# EAGLE design hbridge_v3 (EAGLE 6.4)
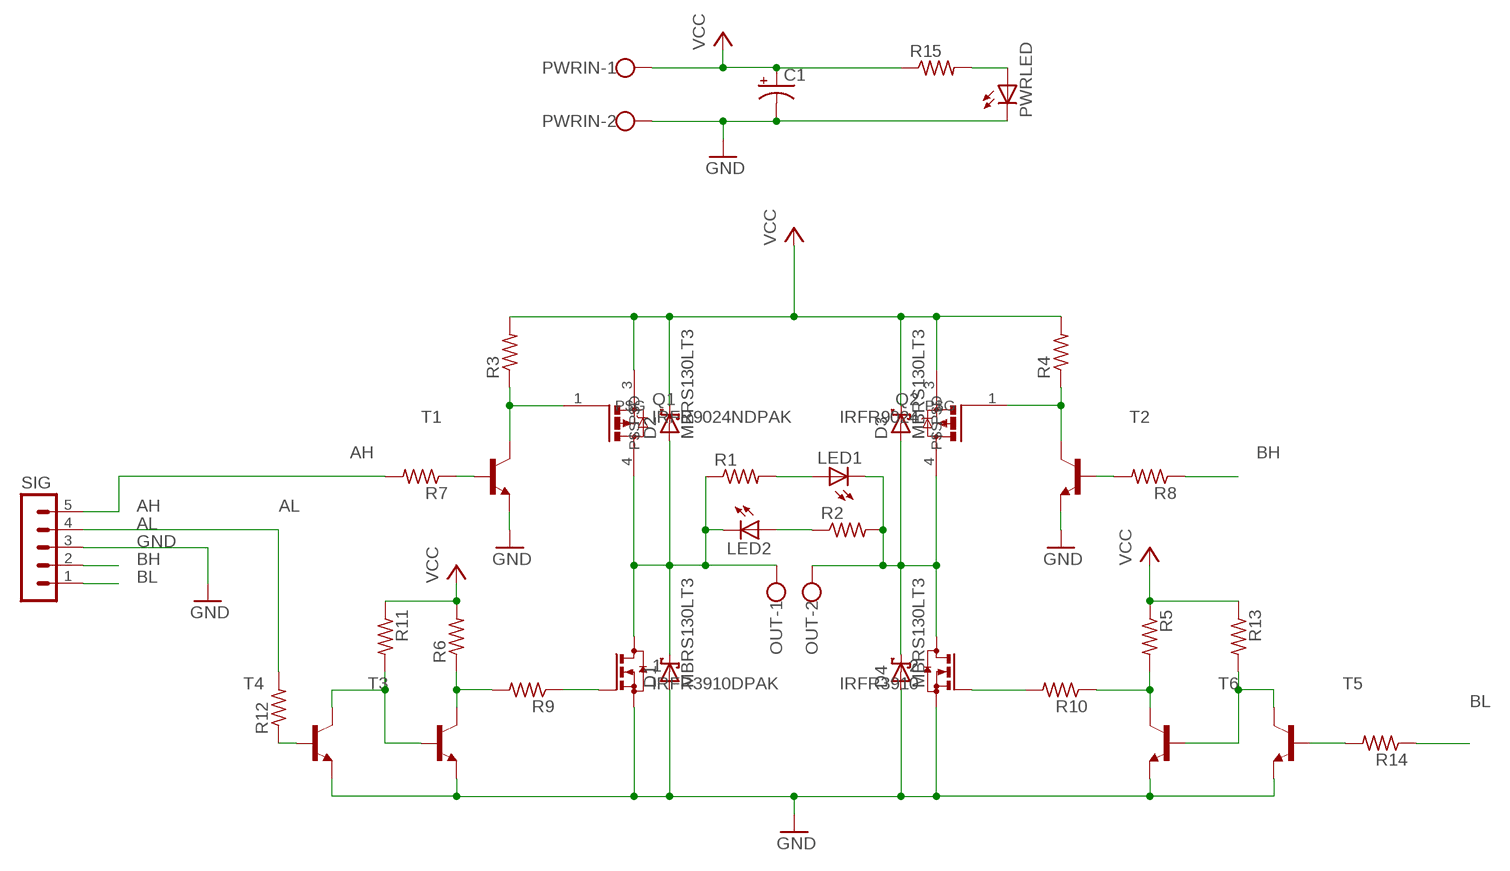
[diagram p0: schematic, sheet 1]

## Parts
1  IRFR3910DPAK  [D-PAK_TO252AA]
2  IRFR3910  IRFR3910DPAK  [D-PAK_TO252AA]
C1  CPOL-USE5-10.5  [E5-10,5]
D1  MBRS130LT3  [SMB]
D2  MBRS130LT3  [SMB]
D3  MBRS130LT3  [SMB]
D4  MBRS130LT3  [SMB]
LED1  LEDCHIP-LED0805  [CHIP-LED0805]
LED2  LEDCHIP-LED0805  [CHIP-LED0805]
OUT  W237-102  [W237-102]
PWRIN  W237-102  [W237-102]
PWRLED  LEDCHIP-LED0805  [CHIP-LED0805]
Q1  IRFR9024NDPAK  [D-PAK_TO252AA]
Q2  IRFR9024  IRFR9024NDPAK  [D-PAK_TO252AA]
R1  R-US_R0805  [R0805]
R2  R-US_R0805  [R0805]
R3  R-US_R0805  [R0805]
R4  R-US_R0805  [R0805]
R5  R-US_R0805  [R0805]
R6  R-US_R0805  [R0805]
R7  R-US_R0805  [R0805]
R8  R-US_R0805  [R0805]
R9  R-US_R0805  [R0805]
R10  R-US_R0805  [R0805]
R11  R-US_R0805  [R0805]
R12  R-US_R0805  [R0805]
R13  R-US_R0805  [R0805]
R14  R-US_R0805  [R0805]
R15  R-US_R0805  [R0805]
SIG  MA05-1  [MA05-1]
T1  MMBT2222ALT1-NPN-SOT23-BEC  [SOT23-BEC]
T2  MMBT2222ALT1-NPN-SOT23-BEC  [SOT23-BEC]
T3  MMBT2222ALT1-NPN-SOT23-BEC  [SOT23-BEC]
T4  MMBT2222ALT1-NPN-SOT23-BEC  [SOT23-BEC]
T5  MMBT2222ALT1-NPN-SOT23-BEC  [SOT23-BEC]
T6  MMBT2222ALT1-NPN-SOT23-BEC  [SOT23-BEC]

## Nets
AH: R7.2 SIG.5
AL: R12.2 SIG.4
BH: R8.1 SIG.2
BL: R14.1 SIG.1
GND: 1.3(S) 2.3(S) C1.- D1.A D4.A PWRIN.2 PWRLED.C SIG.3 T1.E T2.E T3.E T4.E T5.E T6.E
M1: 1.4(D) D1.C D2.A LED2.C OUT.1 Q1.4(P$D) R1.1
M2: 2.4(D) D3.A D4.C LED1.C OUT.2 Q2.4(P$D) R2.2
N$1: LED2.A R2.1
N$2: LED1.A R1.2
N$3: 1.1(G) R9.1
N$4: R6.1 R9.2 T3.C
N$5: R11.2 T3.B T4.C
N$6: Q1.1(P$G) R3.1 T1.C
N$7: Q2.1(P$G) R4.1 T2.C
N$8: 2.1(G) R10.2
N$9: R7.1 T1.B
N$10: R12.1 T4.B
N$11: R8.2 T2.B
N$12: R5.2 R10.1 T6.C
N$14: R13.2 T5.C T6.B
N$17: R14.2 T5.B
N$26: PWRLED.A R15.2
VCC: C1.+ D2.C D3.C PWRIN.1 Q1.3(P$S) Q2.3(P$S) R3.2 R4.2 R5.1 R6.2 R11.1 R13.1 R15.1

## Library data of the parts
1 2 = RobThePyro:IRFR3910: http://www.irf.com/product-info/datasheets/data/irfr3910.pdf
C1 = resistor:CPOL-US: POLARIZED CAPACITOR, American symbol
D1-D4 = diode:MBRS130LT3: Schottky Power Rectifier Source: http://www.onsemi.com/pub/Collateral/MBRS130LT3-D.PDF
LED1 LED2 PWRLED = led:LED: LED OSRAM: - CHIPLED LG R971, LG N971, LY N971, LG Q971, LY Q971, LO R971, LY R971 LH N974, LH R974 LS Q976, LO Q976, LY Q976 LO Q996 - Hyper CHIPLED LW Q18S LB Q993, LB Q99A, LB R99A - SideLED LS A670, LO A670, LY A670, LG A670, LP A670 LB A673, LV A673, LT A673, LW A673 LH A674 LY A675 LS A676, LA A676, LO A676, LY A676, LW A676 LS A679, LY A679, LG A679 - Hyper Micro SIDELED® LS Y876, LA Y876, LO Y876, LY Y876 LT Y87S - SmartLED LW L88C, LW L88S LB L89C, LB L89S, LG L890 LS L89K, LO L89K, LY L89K LS L896, LA L896, LO L896, LY L896 - TOPLED LS T670, LO T670, LY T670, LG T670, LP T670 LSG T670, LSP T670, LSY T670, LOP T670, LYG T670 LG T671, LOG T671, LSG T671 LB T673, LV T673, LT T673, LW T673 LH T674 LS T676, LA T676, LO T676, LY T676, LB T676, LH T676, LSB T676, LW T676 LB T67C, LV T67C, LT T67C, LS T67K, LO T67K, LY T67K, LW E67C LS E67B, LA E67B, LO E67B, LY E67B, LB E67C, LV E67C, LT E67C LW T67C LS T679, LY T679, LG T679 LS T770, LO T770, LY T770, LG T770, LP T770 LB T773, LV T773, LT T773, LW T773 LH T774 LS E675, LA E675, LY E675, LS T675 LS T776, LA T776, LO T776, LY T776, LB T776 LHGB T686 LT T68C, LB T68C - Hyper Mini TOPLED® LB M676 - Mini TOPLED Santana® LG M470 LS M47K, LO M47K, LY M47K Source: http://www.osram.convergy.de LUXEON: - LUMILED® LXK2-PW12-R00, LXK2-PW12-S00, LXK2-PW14-U00, LXK2-PW14-V00 LXK2-PM12-R00, LXK2-PM12-S00, LXK2-PM14-U00 LXK2-PE12-Q00, LXK2-PE12-R00, LXK2-PE12-S00, LXK2-PE14-T00, LXK2-PE14-U00 LXK2-PB12-K00, LXK2-PB12-L00, LXK2-PB12-M00, LXK2-PB14-N00, LXK2-PB14-P00, LXK2-PB14-Q00 LXK2-PR12-L00, LXK2-PR12-M00, LXK2-PR14-Q00, LXK2-PR14-R00 LXK2-PD12-Q00, LXK2-PD12-R00, LXK2-PD12-S00 LXK2-PH12-R00, LXK2-PH12-S00 LXK2-PL12-P00, LXK2-PL12-Q00, LXK2-PL12-R00 Source: www.luxeon.com KINGBRIGHT: KA-3528ASYC Source: www.kingbright.com
OUT PWRIN = con-wago-500:W237-102: WAGO SCREW CLAMP; MPN: 237-102; OC_FARNELL: unknown; OC_NEWARK: 70K9898
Q1 Q2 = RobThePyro:IRFR9024N: http://www.irf.com/product-info/datasheets/data/irfr9024n.pdf
R1-R15 = resistor:R-US_: RESISTOR, American symbol
SIG = con-lstb:MA05-1: PIN HEADER; OC_FARNELL: unknown; OC_NEWARK: unknown
T1-T6 = transistor:*-NPN-: NPN Transistror BF959 corrected 2008.03.06

## Board
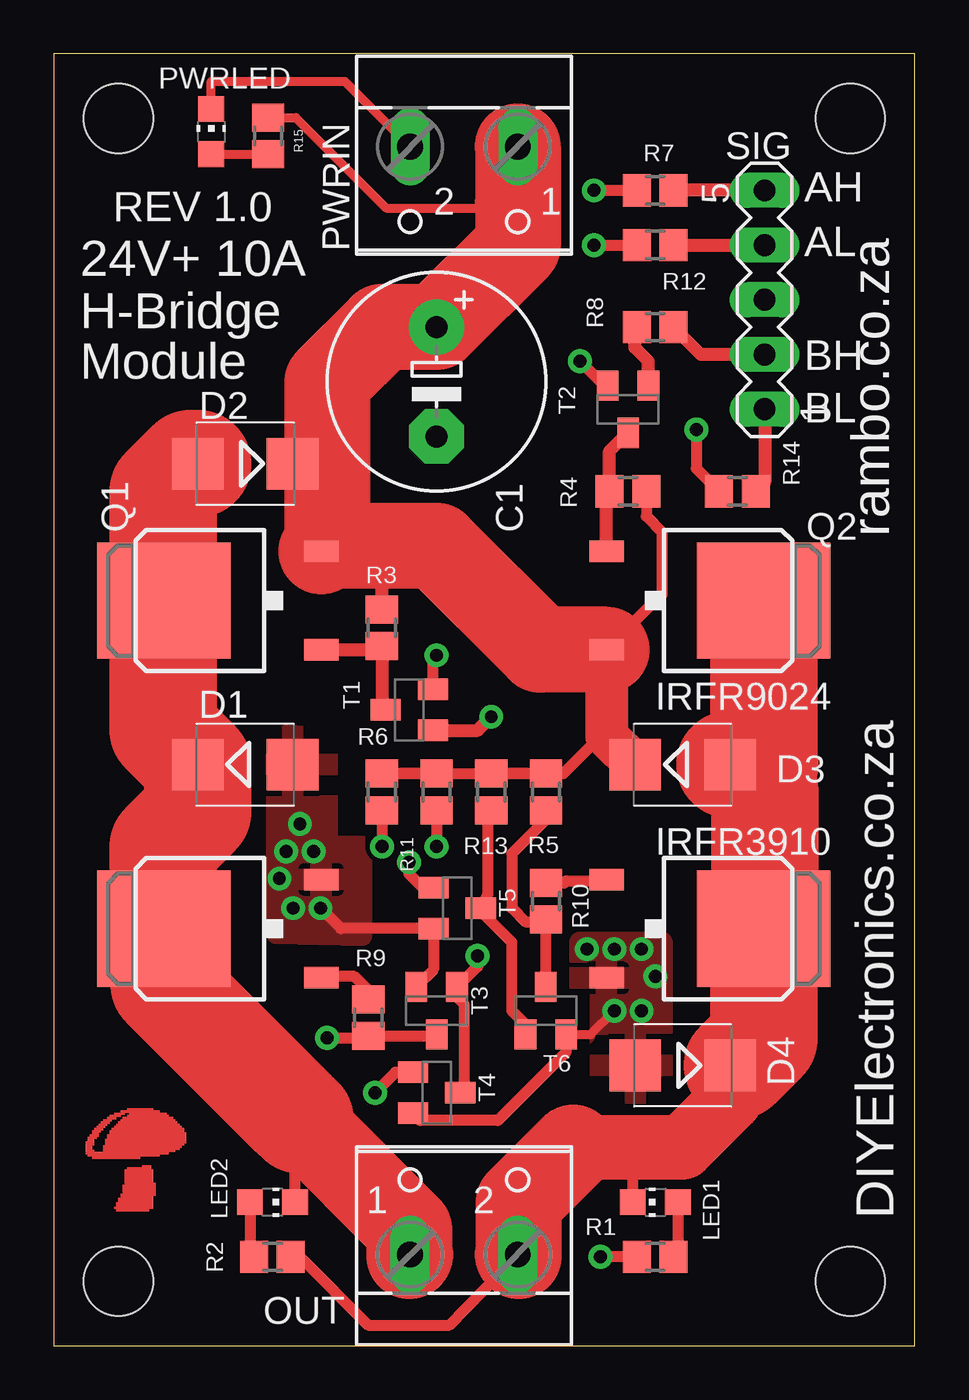
[diagram p1: board, top side]
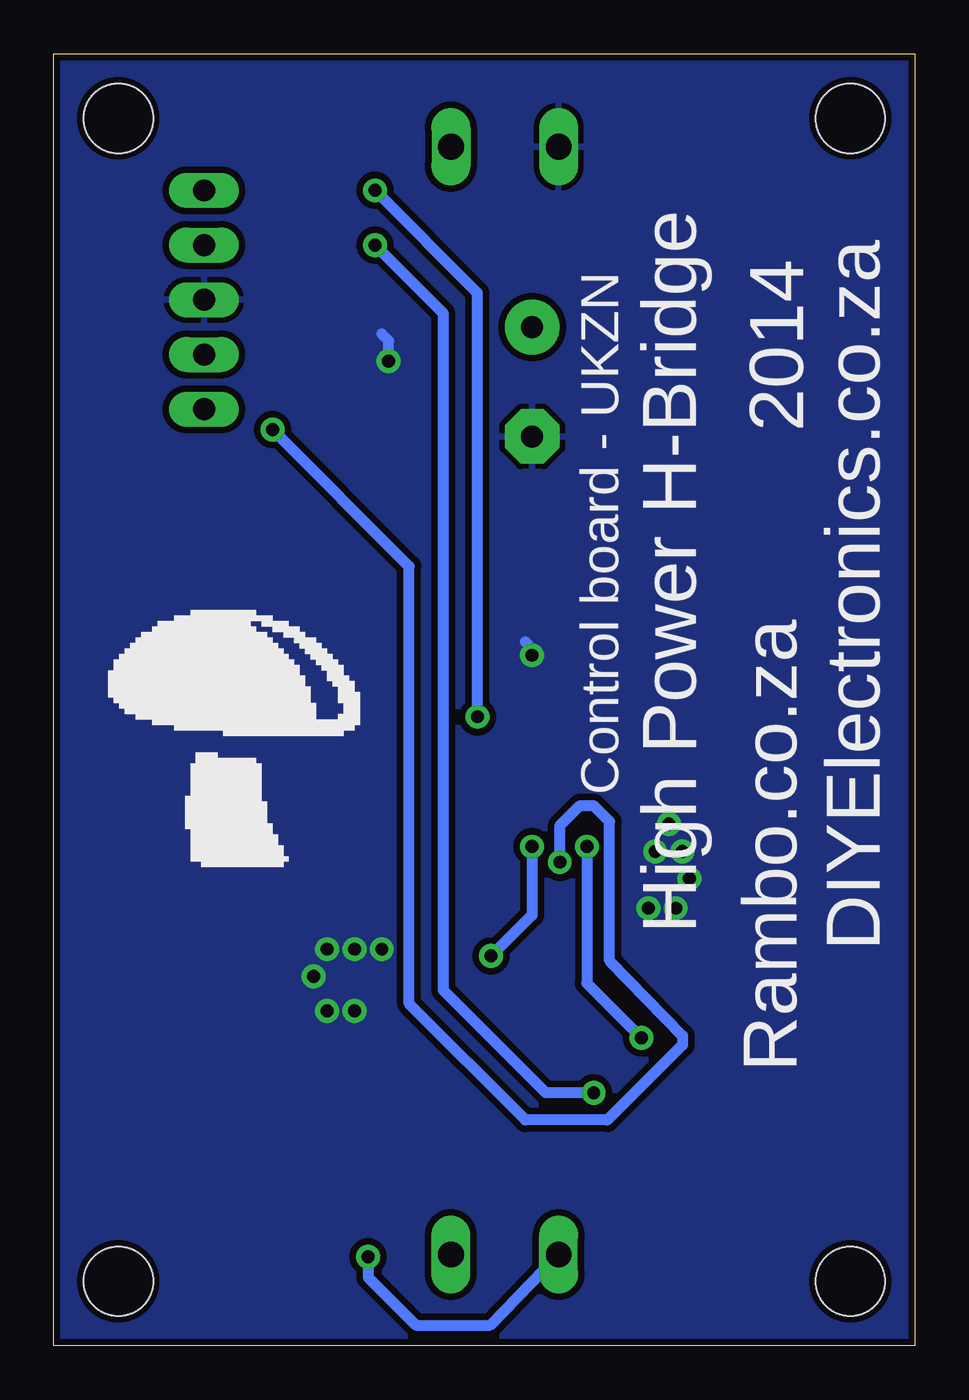
[diagram p2: board, bottom side, seen from below]

Size 40 x 60 mm. Coordinates in mm from the lower left corner, seen from the top.
Outline: 40,0 40,60 0,60 0,0 40,0
Copper layers (1*16): Top 0.035mm / dielectric 1.5mm / Bottom 0.035mm
Design rules "SparkFun": minimum track width 8mil, minimum drill 20mil, track to track 8mil, track to pad 8mil, pad to pad 8mil, via to via 8mil, smd to smd 8mil, copper to edge 10mil, drill to drill 8mil, minimum pad ring 12mil, minimum via ring 10mil, stop-mask expansion 4mil, vias tented up to drill 25mil, thermal gap 10mil
Holes 3.2 mm at 3,3 37,3 37,57 3,57

### Footprints (pad centres in the part's own frame; a part is rotated, then mirrored left to right if it is on the bottom)
D-PAK_TO252AA = smd 1 x 1.6: 1 -2.28,-4.8; 3 2.28,-4.8 | smd 5.4 x 6.2: 4 0,2.5
E5-10,5 = drill 1.016 pad 2.54: + -2.54,0 | drill 1.016 pad 2.54 octagon: - 2.54,0
SMB = smd 2.4 x 2.4: A 2.2,0; C -2.2,0
CHIP-LED0805 = smd 1.2 x 1.2: A 0,-1.05; C 0,1.05
W237-102 = drill 1.194 long: 1 -2.5,-1.27; 2 2.5,-1.27
R0805 = smd 1.3 x 1.5: 1 -0.85,0; 2 0.85,0
MA05-1 = drill 1.016 long: 1 -5.08,0; 2 -2.54,0; 3 0,0; 4 2.54,0; 5 5.08,0
SOT23-BEC = smd 1 x 1.4: B -0.95,-1.1; C 0,1.1; E 0.95,-1.1

### Placement (x,y rotation side)
1  7.62,19.37 90 top
2  30.48,19.37 270 top
C1  17.78,44.77 270 top
D1  8.89,26.99 0 top
D2  8.89,40.96 180 top
D3  29.21,26.99 0 top
D4  29.21,13.02 180 top
LED1  27.94,6.67 90 top
LED2  10.16,6.67 270 top
OUT  19.05,5.5 0 top
PWRIN  19.05,54.42 180 top
PWRLED  7.32,56.39 0 top
Q1  7.62,34.61 90 top
Q2  30.48,34.61 270 top
R1  27.94,4.13 0 top
R2  10.16,4.13 0 top
R3  15.24,33.34 90 top
R4  26.67,39.69 0 top
R5  22.86,25.72 270 top
R6  15.24,25.72 90 top
R7  27.94,53.66 0 top
R8  27.94,47.31 180 top
R9  14.61,15.24 270 top
R10  22.86,20.64 90 top
R11  17.78,25.72 270 top
R12  27.94,51.12 0 top
R13  20.32,25.72 270 top
R14  31.75,39.69 180 top
R15  9.96,56.18 270 top
SIG  33.02,48.58 90 top
T1  16.51,29.53 90 top
T2  26.67,43.5 180 top
T3  17.78,15.56 180 top
T4  17.78,11.75 270 top
T5  18.73,20.32 270 top
T6  22.86,15.56 0 top

### Tracks (layer width: path | path; a pad name or v marks a point on that pad's centre or on a via)
AH
  Top 0.6: SIG.5 R7.2
AL
  Top 0.6: R12.2 SIG.4
BH
  Top 0.6: SIG.2 30.06,46.04 R8.1
BL
  Top 0.6: SIG.1 33.02,40.11 R14.1
GND  (via drill 0.6)
  Top 0.406: PWRLED.C 7.32,58.73 13.52,58.73 PWRIN.2 | T6.E 24.93,14.46 v26.04,15.56
  Top 0.5: T6.E 23.81,13.65 20.62,10.46 17.01,10.46 T4.E | T3.E 17.63,17.46 T5.E 13.33,19.37 v12.38,20.32 | T1.E 17.61,31.9 v17.78,32.07 | T2.E 25.57,44.6 v24.45,45.72
  Bottom 0.5: v17.78,32.07 17.78,32.38 18.1,32.7 | v24.45,45.72 24.45,46.67 24.77,46.99
  other vias: 24.77,18.41 26.04,18.41 27.3,18.41 27.94,17.14 27.3,15.56 11.11,20.32 10.48,21.69 10.79,22.96 12.06,22.96 11.43,24.23
  pour Bottom (isolate 0.305): -0.18,60.14 0,0 40.05,0 40.23,60.14
  pour Top: 10.34,28.36 10.34,19.15 14.29,19.05 14.29,23.18 12.7,23.18 12.7,28.26
  pour Top: 28.26,11.75 25.4,11.75 25.4,16.19 24.45,16.19 24.45,18.73 28.26,18.73
M1  (via drill 0.6)
  Top 0.5: LED2.C 11.21,10.7 11.11,10.79 | R1.1 v25.4,4.13
  Top 4: 11.43,10.48 16.51,5.4 16.51,4.17 OUT.1
  Top 5: D2.A 6.35,40.96 5.08,39.69 5.08,34.61 | 5.08,34.61 5.08,28.6 D1.C 6.69,24.79 5.08,23.18 5.08,19.41 1.4 5.12,16.79 11.11,10.79 11.43,10.48 | Q1.4 5.08,34.61
  Bottom 0.5: v25.4,4.13 25.4,3.17 23.18,0.95 19.73,0.95 OUT.1
M2
  Top 0.5: LED1.C 26.89,9.11 26.99,9.21 | R2.2 11.43,4.13 14.61,0.95 18.38,0.95 OUT.2
  Top 3: 33.02,26.99 D3.A | 31.75,13.02 D4.C 31.41,11.41 29.21,9.21 26.99,9.21 24.13,9.21
  Top 4: 24.13,9.21 21.59,6.67 21.59,4.17 OUT.2
  Top 5: Q2.4 32.98,27.03 33.02,26.99 | D3.A 31.75,26.99 33.02,25.72 33.02,19.41 2.4 32.98,14.25 31.75,13.02
N$1
  Top 0.5: LED2.A 9.11,4.33 R2.1
N$2
  Top 0.5: LED1.A 28.99,4.33 R1.2
N$3
  Top 0.5: R9.1 14.71,16.41 13.97,17.14 12.48,17.14 1.1
N$4  (via drill 0.6)
  Top 0.5: T3.C 17.71,14.39 R9.2 14.5,14.29 v12.7,14.29 | R6.1 v15.24,23.18
  Bottom 0.5: v15.24,23.18 15.24,16.83 v12.7,14.29
N$5  (via drill 0.6)
  Top 0.5: R11.2 v17.78,23.18 | v19.68,18.1 19.68,17.61 T3.B 18.73,16.2 19.05,15.88 19.05,11.92 T4.C
  Bottom 0.5: v17.78,23.18 17.78,20 v19.68,18.1
N$6
  Top 0.6: Q1.1 15.08,32.33 R3.1 15.24,29.7 T1.C
N$7
  Top 0.6: Q2.1 25.68,39.55 R4.1 25.82,41.55 T2.C
N$8
  Top 0.5: R10.2 23.71,21.49 23.81,21.59 25.62,21.59 2.1
N$9  (via drill 0.6)
  Top 0.5: v25.08,53.66 R7.1
  Top 0.6: T1.B 19.69,28.58 v20.32,29.21
  Bottom 0.5: v20.32,29.21 20.32,48.9 v25.08,53.66
N$10  (via drill 0.6)
  Top 0.5: T4.B 15.87,12.7 v14.92,11.75 | v25.08,51.12 R12.1
  Bottom 0.5: v14.92,11.75 17.14,11.75 21.91,16.51 21.91,47.94 v25.08,51.12
N$11
  Top 0.6: T2.B 27.62,45.72 26.99,46.35 26.99,47.2 R8.2
N$12
  Top 0.5: R5.2 22.86,24.45 21.27,22.86 21.27,20.32 21.91,19.68 22.76,19.68 R10.1 T6.C
N$14
  Top 0.5: R13.2 20.15,24.7 20.15,20.95 T5.C 20,20.47 20,20 21.27,18.73 21.27,15.56 21.91,14.92 T6.B
N$17  (via drill 0.6)
  Top 0.5: T5.B 17.14,21.27 16.5,21.91 v16.5,22.45 | v29.84,42.55 29.84,40.74 R14.2
  Bottom 0.5: v29.84,42.55 23.5,36.2 23.5,15.88 18.1,10.48 14.29,10.48 10.79,13.97 10.79,14.39 14.19,17.88 14.19,24.35 14.92,25.08 15.56,25.08 16.51,24.13 16.51,22.47 v16.5,22.45
N$26
  Top 0.406: PWRLED.A R15.2
VCC
  Top 0.406: R15.1 11.24,57.03 15.44,52.83 21.35,52.83 21.55,53.03
  Top 0.5: R11.1 R6.2 R13.1 | R5.1 R13.1 | R13.1 23.67,26.57 25.68,28.57 | R4.2 27.52,38.52 28.26,37.78 28.26,34.91 Q2.3
  Top 0.6: R3.2 15.24,37.15
  Top 2: D2.C 12.7,40.96 | Q2.3 25.68,28.57 25.68,28.32 D3.C
  Top 4: PWRIN.1 21.55,53.03 21.55,51.08 C1.+ 15.24,47.31 12.7,44.77 12.7,40.96 12.7,37.17 Q1.3 12.68,37.15 15.24,37.15 17.78,37.15 22.6,32.33 Q2.3
(copper drawn outside any net)
  shapes: Top area x62

### Text on the board
tPlace: AH | REV 1.0 | AL | 24V+ 10A | H-Bridge | Module | BH | BL | rambo.co.za | DIYElectronics.co.za
bPlace: High Power H-Bridge | DIYElectronics.co.za | 2014 | Control board - UKZN | Rambo.co.za